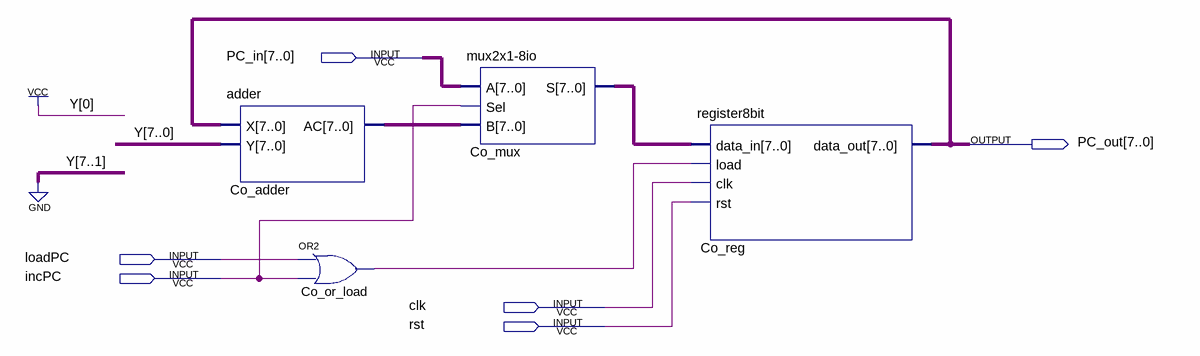
[diagram p0: schematic sheet]
// Quartus schematic regPC.bdf as structural Verilog: 4 symbols, 6 pins
module regPC (
  input  [7:0] PC_in,
  input  loadPC,
  input  incPC,
  input  clk,
  input  rst,
  output [7:0] PC_out
);

  wire Co_or_load_out;
  wire [7:0] Co_adder_ac, Co_mux_s;

  adder Co_adder (.X(PC_out), .Y(8'b00000001), .AC(Co_adder_ac));
  or Co_or_load (Co_or_load_out, loadPC, incPC);
  \mux2x1-8io  Co_mux (.A(PC_in), .Sel(incPC), .B(Co_adder_ac), .S(Co_mux_s));
  register8bit Co_reg (.data_in(Co_mux_s), .load(Co_or_load_out), .clk(clk), .rst(rst), .data_out(PC_out));
endmodule
